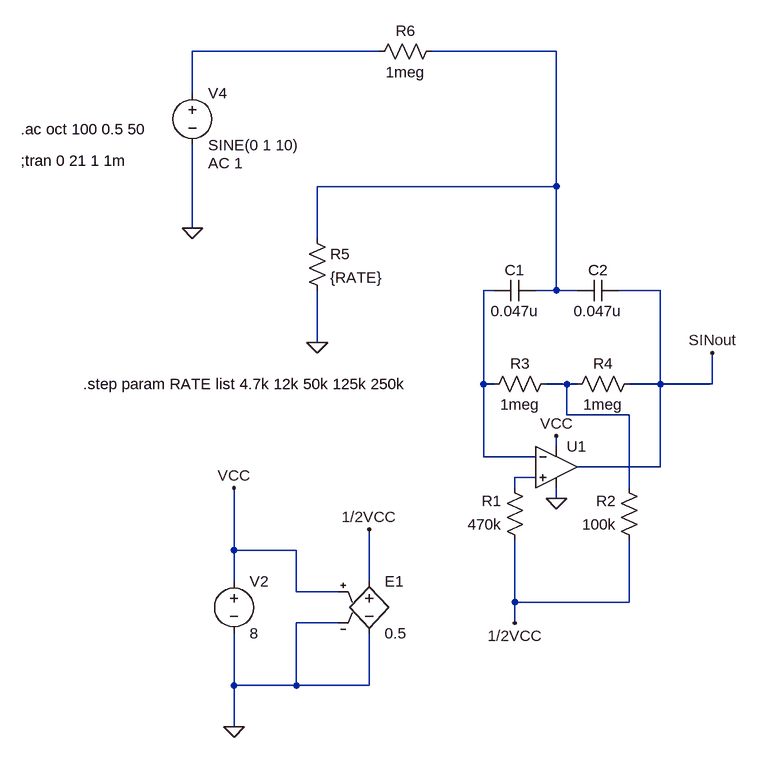
[diagram p0: schematic VB-2_OSC_BPF.asc]
VB-2_OSC_BPF.asc, the LTspice schematic file:
Version 4
SHEET 1 1440 680
WIRE -96 -448 -384 -448
WIRE 176 -448 -16 -448
WIRE -384 -384 -384 -448
WIRE 176 -240 176 -448
WIRE 176 -240 -192 -240
WIRE -384 -176 -384 -304
WIRE -192 -160 -192 -240
WIRE 80 -80 64 -80
WIRE 176 -80 176 -240
WIRE 176 -80 144 -80
WIRE 208 -80 176 -80
WIRE 336 -80 272 -80
WIRE -192 0 -192 -80
WIRE 64 64 64 -80
WIRE 80 64 64 64
WIRE 192 64 160 64
WIRE 208 64 192 64
WIRE 336 64 336 -80
WIRE 336 64 288 64
WIRE 416 64 416 16
WIRE 416 64 336 64
WIRE 192 112 192 64
WIRE 288 112 192 112
WIRE 176 160 176 144
WIRE 64 176 64 64
WIRE 144 176 64 176
WIRE 336 192 336 64
WIRE 336 192 208 192
WIRE 144 208 112 208
WIRE 112 224 112 208
WIRE 288 224 288 112
WIRE 176 240 176 224
WIRE -320 320 -320 224
WIRE -224 320 -320 320
WIRE -320 368 -320 320
WIRE -112 368 -112 288
WIRE -224 384 -224 320
WIRE -160 384 -224 384
WIRE 112 400 112 304
WIRE 288 400 288 304
WIRE 288 400 112 400
WIRE -160 432 -224 432
WIRE 112 432 112 400
WIRE -320 528 -320 448
WIRE -224 528 -224 432
WIRE -224 528 -320 528
WIRE -112 528 -112 448
WIRE -112 528 -224 528
WIRE -320 592 -320 528
FLAG 176 240 0
FLAG -320 592 0
FLAG -320 224 VCC
FLAG 416 16 SINout
FLAG -192 0 0
FLAG -384 -176 0
FLAG 176 144 VCC
FLAG -112 288 1/2VCC
FLAG 112 432 1/2VCC
SYMBOL res 128 320 R180
WINDOW 0 36 76 Left 2
WINDOW 3 36 40 Left 2
SYMATTR InstName R1
SYMATTR Value 470k
SYMBOL res 304 320 R180
WINDOW 0 36 76 Left 2
WINDOW 3 36 40 Left 2
SYMATTR InstName R2
SYMATTR Value 100k
SYMBOL res 64 80 R270
WINDOW 0 32 56 VTop 2
WINDOW 3 0 56 VBottom 2
SYMATTR InstName R3
SYMATTR Value 1meg
SYMBOL res 192 80 R270
WINDOW 0 32 56 VTop 2
WINDOW 3 0 56 VBottom 2
SYMATTR InstName R4
SYMATTR Value 1meg
SYMBOL cap 144 -96 R90
WINDOW 0 0 32 VBottom 2
WINDOW 3 32 32 VTop 2
SYMATTR InstName C1
SYMATTR Value 0.047u
SYMBOL cap 272 -96 R90
WINDOW 0 0 32 VBottom 2
WINDOW 3 32 32 VTop 2
SYMATTR InstName C2
SYMATTR Value 0.047u
SYMBOL Opamps\\UniversalOpamp2 176 192 R0
SYMATTR InstName U1
SYMBOL res -208 -176 R0
SYMATTR InstName R5
SYMATTR Value {RATE}
SYMBOL res 0 -464 R90
WINDOW 0 0 56 VBottom 2
WINDOW 3 32 56 VTop 2
SYMATTR InstName R6
SYMATTR Value 1meg
SYMBOL voltage -384 -400 R0
WINDOW 123 24 124 Left 2
WINDOW 39 0 0 Left 2
SYMATTR Value2 AC 1
SYMATTR InstName V4
SYMATTR Value SINE(0 1 10)
SYMBOL voltage -320 352 R0
WINDOW 123 0 0 Left 2
WINDOW 39 0 0 Left 2
SYMATTR InstName V2
SYMATTR Value 8
SYMBOL e -112 352 R0
SYMATTR InstName E1
SYMATTR Value 0.5
TEXT -648 -280 Left 2 !;tran 0 21 1 1m
TEXT -648 -328 Left 2 !.ac oct 100 0.5 50
TEXT -552 64 Left 2 !.step param RATE list 4.7k 12k 50k 125k 250k

The netlist it stands for:
* VB-2_OSC_BPF.asc
R1 1/2VCC N005 470k
R2 1/2VCC N004 100k
R3 N003 N004 1meg
R4 N004 SINout 1meg
C1 N002 N003 0.047u
C2 SINout N002 0.047u
XU1 N005 N003 VCC 0 SINout level.2 Avol=1Meg GBW=10Meg Slew=10Meg ilimit=25m rail=0 Vos=0 phimargin=45 en=0 enk=0 in=0 ink=0 Rin=500Meg  ; pins IN+ IN- V+ V- OUT
R5 N002 0 {RATE}
R6 N002 N001 1meg
V4 N001 0 SINE(0 1 10) AC 1
V2 VCC 0 8
E1 1/2VCC 0 VCC 0 0.5
;tran 0 21 1 1m
.ac oct 100 0.5 50
.step param RATE list 4.7k 12k 50k 125k 250k
.lib UniversalOpamps2.sub
.backanno
.end